# Altium schematic sheet LED1.SchDoc
size A4; Organization: Altium Limited; Address1: L3, 12a Rodborough Rd; Address2: Frenchs Forest; Address3: NSW; Address4: Australia 2086; SheetNumber: 2; SheetTotal: 2
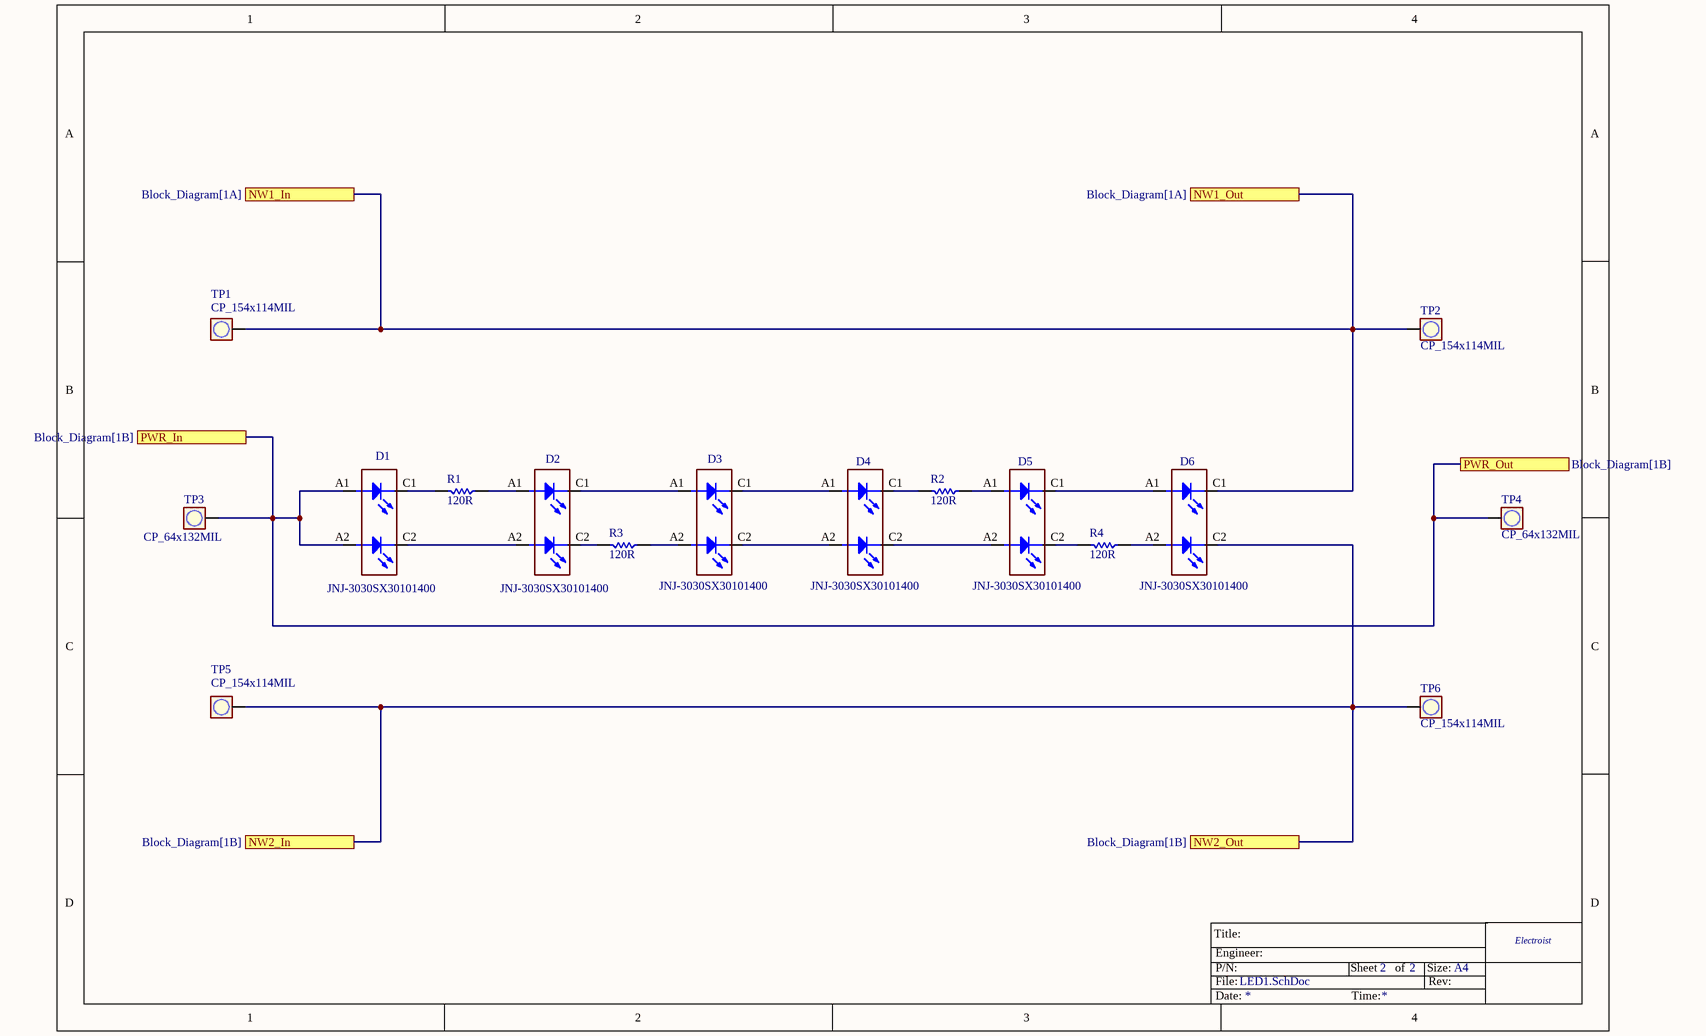
[diagram p0: LED1.SchDoc]

## Parts
D1  JNJ-3030SX30101400  [LED_3030_4P_1]
D2  JNJ-3030SX30101400  [LED_3030_4P_1]
D3  JNJ-3030SX30101400  [LED_3030_4P_1]
D4  JNJ-3030SX30101400  [LED_3030_4P_1]
D5  JNJ-3030SX30101400  [LED_3030_4P_1]
D6  JNJ-3030SX30101400  [LED_3030_4P_1]
R1  120R  [RES_CHIP_3216[1206]_N]
R2  120R  [RES_CHIP_3216[1206]_N]
R3  120R  [RES_CHIP_3216[1206]_N]
R4  120R  [RES_CHIP_3216[1206]_N]
TP1  CP_154x114MIL  [TST_CP_154x114MIL]
TP2  CP_154x114MIL  [TST_CP_154x114MIL]
TP3  CP_64x132MIL  [TST_CP_64x132MIL_1]
TP4  CP_64x132MIL  [TST_CP_64x132MIL_1]
TP5  CP_154x114MIL  [TST_CP_154x114MIL]
TP6  CP_154x114MIL  [TST_CP_154x114MIL]

## Ports
NW1_In (see Block_Diagram[1A]), NW1_Out (see Block_Diagram[1A]), NW2_In (see Block_Diagram[1B]), NW2_Out (see Block_Diagram[1B]), PWR_In (see Block_Diagram[1B]), PWR_Out (see Block_Diagram[1B])

## Nets
NW1_In: D6.C1 TP1.1 TP2.1 ; port NW1_In, port NW1_Out
NW2_In: D6.C2 TP5.1 TP6.1 ; port NW2_In, port NW2_Out
PWR_In: D1.A1 D1.A2 TP3.1 TP4.1 ; port PWR_In, port PWR_Out
NetD1_C1: D1.C1 R1.2
NetD1_C2: D1.C2 D2.A2
NetD2_A1: D2.A1 R1.1
NetD2_C1: D2.C1 D3.A1
NetD2_C2: D2.C2 R3.2
NetD3_A2: D3.A2 R3.1
NetD3_C1: D3.C1 D4.A1
NetD3_C2: D3.C2 D4.A2
NetD4_C1: D4.C1 R2.2
NetD4_C2: D4.C2 D5.A2
NetD5_A1: D5.A1 R2.1
NetD5_C1: D5.C1 D6.A1
NetD5_C2: D5.C2 R4.2
NetD6_A2: D6.A2 R4.1

## Notes on the sheet
- Title:
- File:
- P/N:
- Engineer:
- Sheet
- of
- Size:
- Rev:
- A4
- Electroist
- Date:
- Time:

## Library data of the parts
D1-D6 = 15: Dual LED, 3030 4 pin package; Manufacturer: JNJ Optoelectronics; ID: 15; Voltage: 3.1V; Current: 150mA; SMD/THD: SMD; Alternates: Guangzhou Mingyi Optoelectronics: 854-1; Part Number: JNJ-3030SX30101400; Pin Count: 4; Value: JNJ-3030SX30101400; ComponentLink1Description: Component web page; ComponentLink1URL: https://www.lcsc.com/product-detail/C19185854.html?s_z=s_C19185854; Manufacturer P/N: JNJ-3030SX30101400; Published Date: 2025-08-29; Publisher: YE
R1-R4 = 43: 120 ohm, 1206, 250 mW, 200 V, %10; Part Number: 120R_1206; ID: 43; Voltage: 200V; Power: 250mW; Tolerance(%): 10; Type 1: Film; SMD/THD: SMD; Pin Count: 2; Value: 120R; Package Reference: 1206; Published Date: 19.03.2021; Publisher: YE
TP1 TP2 TP5 TP6 = 4: no via; ID: 4; SMD/THD: Manual; Part Number: CP_154x114MIL; Pin Count: 1; Value: CP_154x114MIL; Published Date: 2025-08-29; Publisher: YE
TP3 TP4 = 5: includes 3 vias; ID: 5; SMD/THD: Manual; Part Number: CP_64x132MIL; Pin Count: 1; Value: CP_64x132MIL; Published Date: 2025-08-29; Publisher: YE